# Altium schematic sheet TIDA-01560_BlankSheet.SchDoc
size 431 x 279 mm; Date: Not shown in title block; ApprovedBy: Not shown in title block; CheckedBy: Not shown in title block; Author: Not shown in title block; CompanyName: Not shown in title block; Engineer: Not shown in title block; Organization: Not shown in title block; Address1: Not shown in title block; Address2: Not shown in title block; Address3: Not shown in title block; Address4: Not shown in title block; DocumentNumber: 1; Revision: Use project parameter SCH_Rev; SheetNumber: 2; SheetTotal: 2; PageSetup: Record=PageOptions|CenterHorizontal=True|CenterVertical=True|PrintScale=1.00|XCorrection=1.00|YCorrection=1.00|PrintKind=0|BorderSize=5000000|LeftOffset=0|BottomOffset=0|Orientation=2|PaperLength=1000|PaperWidth=1000|Scale=100|PaperSource=15|PrintQuality=600|MediaType=1|DitherType=10|PaperKind=Letter|PrintScaleMode=1; CurrentTime: Not shown in title block; CurrentDate: Not shown in title block; Time: Not shown in title block; DocumentFullPathAndName: Not shown in title block; DocumentName: Not shown in title block; ModifiedDate: Not shown in title block; ImagePath: Not shown in title block
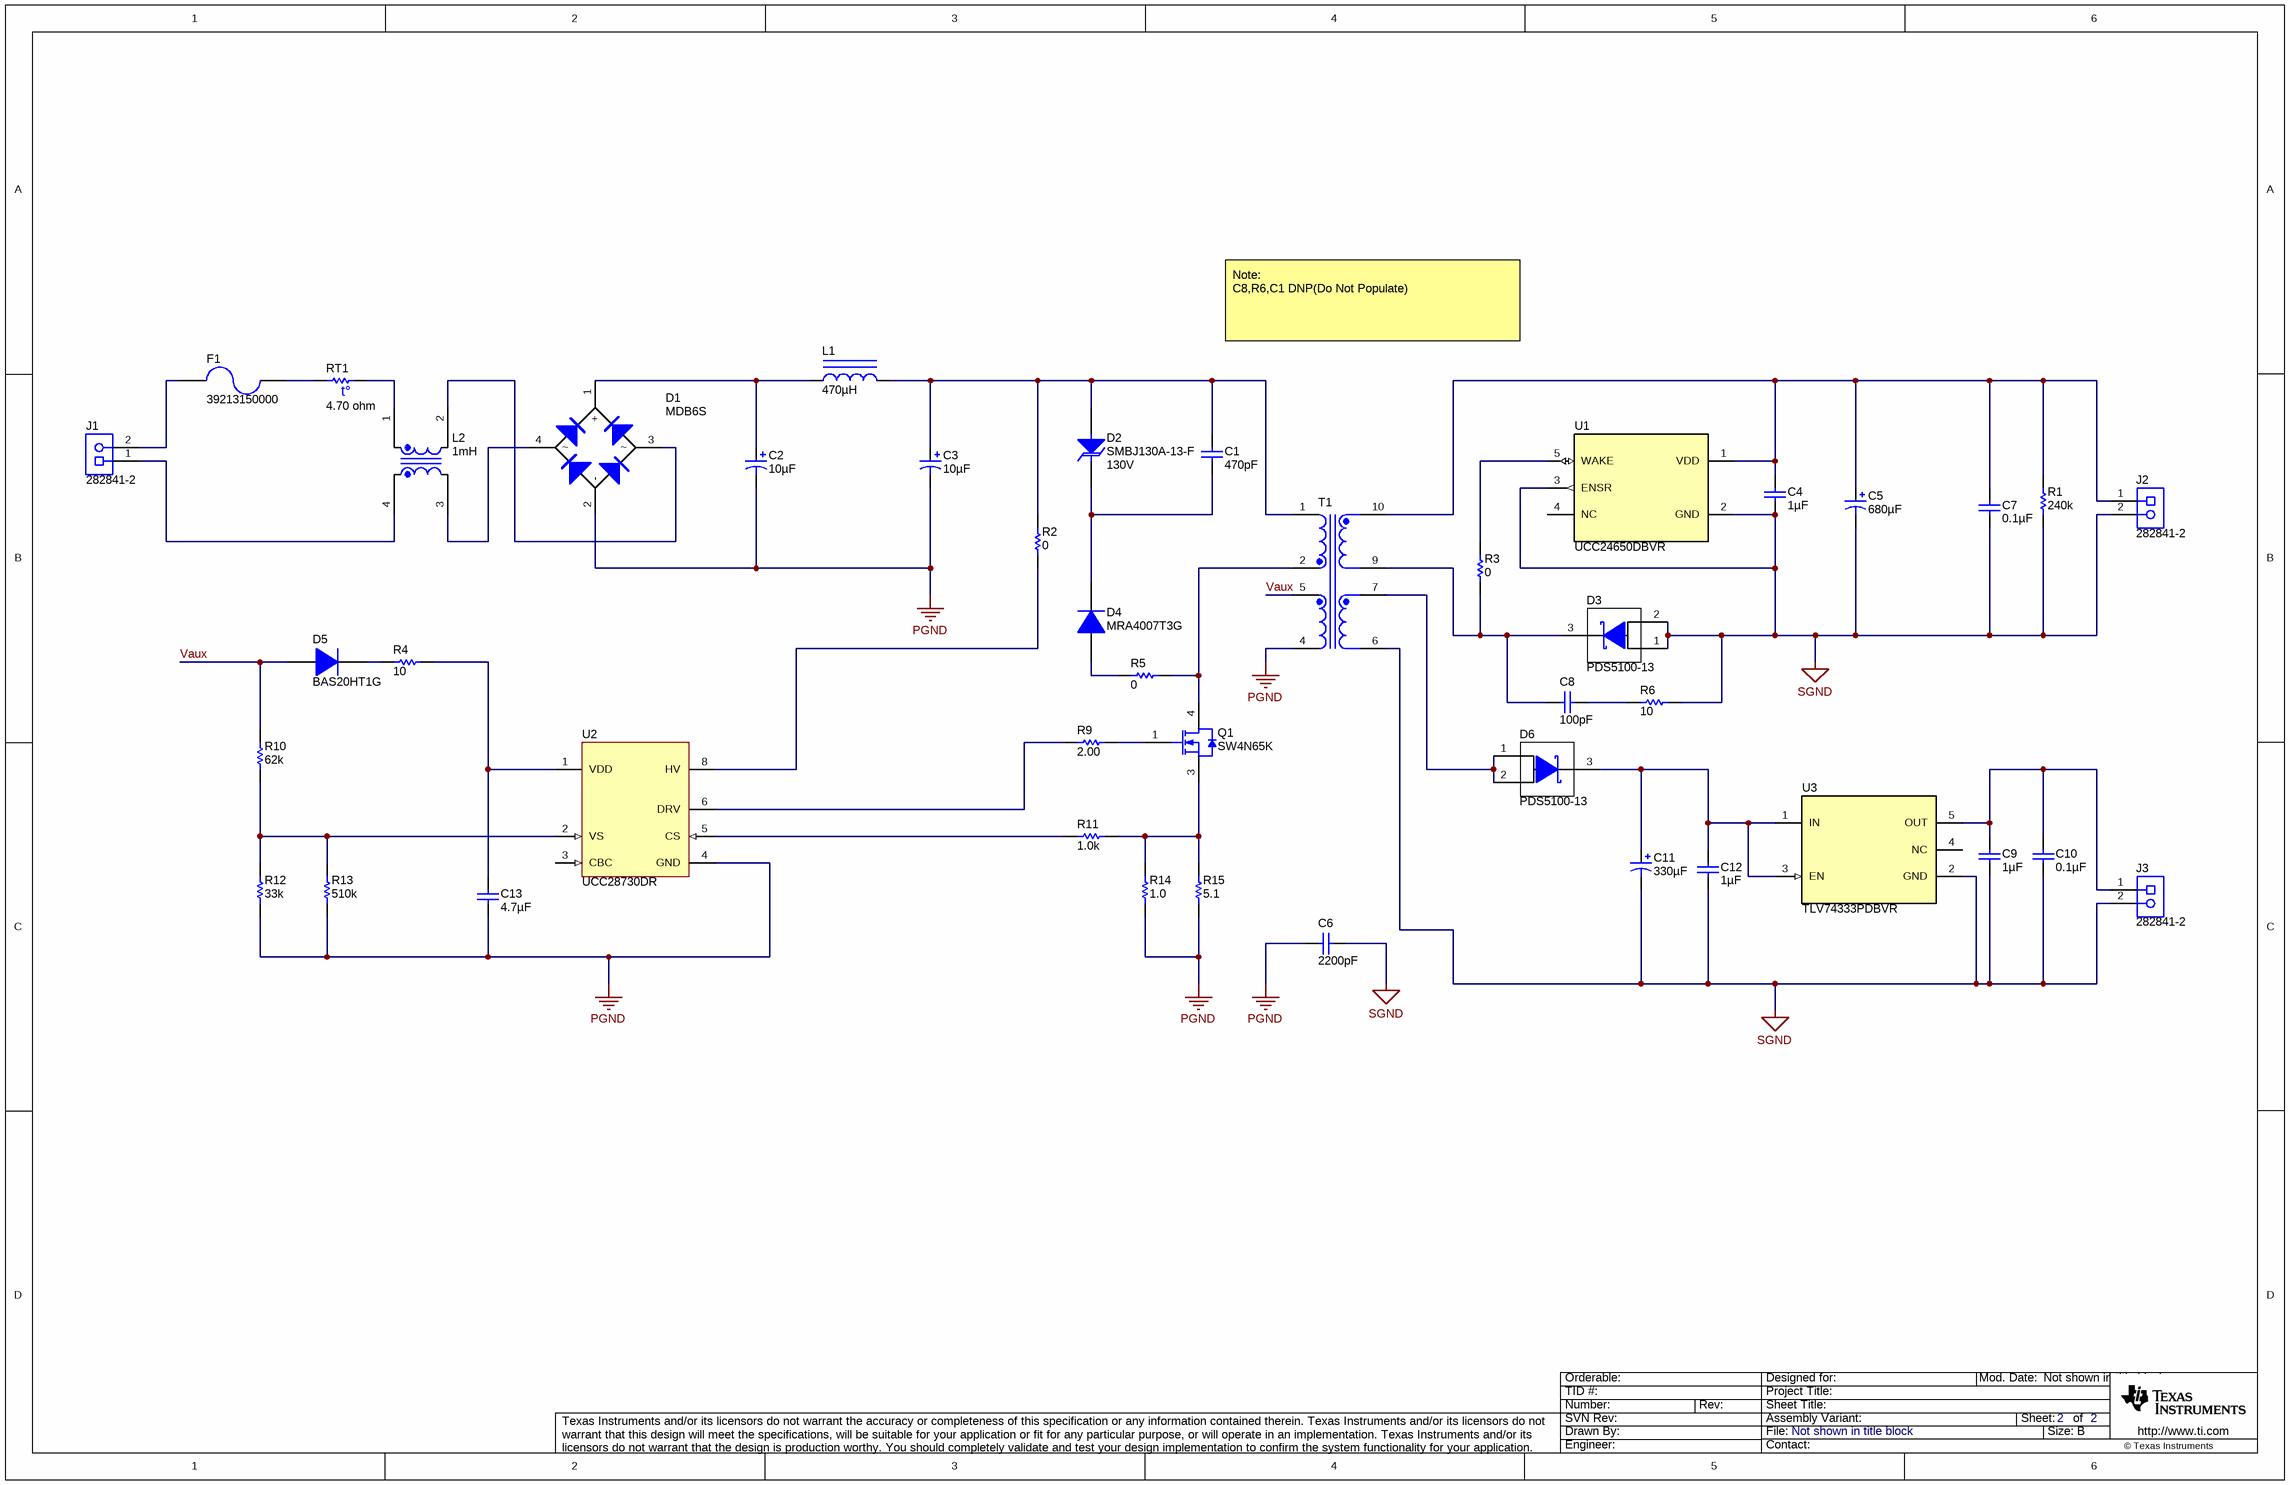
[diagram p0: TIDA-01560_BlankSheet.SchDoc]

## Parts
C1  ValueDisplayed: 470pF  [1206]  (hidden comment: GRM31A7U2J471JW31D)
C2  ValueDisplayed: 10µF  [CY_1000x1600]  (hidden comment: UCY2G100MPD1TD)
C3  ValueDisplayed: 10µF  [CY_1000x1600]  (hidden comment: UCY2G100MPD1TD)
C4  ValueDisplayed: 1µF  [0603]  (hidden comment: 06033C105KAT2A)
C5  ValueDisplayed: 680µF  [R7_1000x1250]  (hidden comment: APSG200ELL681MJB5S)
C6  ValueDisplayed: 2200pF  [KX_1000x800x1400]  (hidden comment: DE1E3KX222MN5AA01)
C7  ValueDisplayed: 0.1µF  [0603]  (hidden comment: C0603C104K3RACTU)
C8  ValueDisplayed: 100pF  [0805_HV]  (hidden comment: GCM2165C2A101JA16D)
C9  ValueDisplayed: 1µF  [0603]  (hidden comment: C1608X7R1E105K080AB)
C10  ValueDisplayed: 0.1µF  [0603]  (hidden comment: C0603C104K3RACTU)
C11  ValueDisplayed: 330µF  [SM_RADIAL_6.3AMM]  (hidden comment: 875105144010)
C12  ValueDisplayed: 1µF  [0603]  (hidden comment: C1608X7R1E105K080AB)
C13  ValueDisplayed: 4.7µF  [1206_180]  (hidden comment: C3216X7R1H475K160AC)
D1  MDB6S  [MICRODIP_4]
D2  SMBJ130A-13-F  value 130V  [SMB]
D3  PDS5100-13  [PowerDI5]
D4  MRA4007T3G  [SMA]
D5  BAS20HT1G  [sod-323]
D6  PDS5100-13  [PowerDI5]
F1  39213150000  [FUSE_392]
J1  282841-2  [TEC_282841-2]
J2  282841-2  [TEC_282841-2]
J3  282841-2  [TEC_282841-2]
L1  ValueDisplayed: 470µH  [WE-TI_5075]  (hidden comment: 7447462471)
L2  ValueDisplayed: 1mH  [WE-CMB_XS]  (hidden comment: 744821201)
Q1  SW4N65K  [TO-252]
R1  ValueDisplayed: 240k  [0805_HV]  (hidden comment: CRCW0805240KJNEA)
R2  ValueDisplayed: 0  [1206]  (hidden comment: CRCW12060000Z0EA)
R3  ValueDisplayed: 0  [0805_HV]  (hidden comment: CRCW08050000Z0EA)
R4  ValueDisplayed: 10  [0805_HV]  (hidden comment: CRCW080510R0JNEA)
R5  ValueDisplayed: 0  [1206]  (hidden comment: CRCW12060000Z0EA)
R6  ValueDisplayed: 10  [1206]  (hidden comment: CRCW120610R0JNEA)
R9  ValueDisplayed: 2.00  [0603]  (hidden comment: CRCW06032R00FKEA)
R10  ValueDisplayed: 62k  [0805_HV]  (hidden comment: CRCW080562K0JNEA)
R11  ValueDisplayed: 1.0k  [0603]  (hidden comment: CRCW06031K00JNEA)
R12  ValueDisplayed: 33k  [0603]  (hidden comment: CRCW060333K0JNEA)
R13  ValueDisplayed: 510k  [0603]  (hidden comment: CRCW0603510KJNEA)
R14  ValueDisplayed: 1.0  [0805_HV]  (hidden comment: CRCW08051R00JNEA)
R15  ValueDisplayed: 5.1  [0805_HV]  (hidden comment: CRCW08055R10JNEA)
RT1  value 4.70 ohm  [S153]  (hidden comment: B57153S0479M051)
T1  750343769,Rev02  [PCBComponent_1]  (value not drawn)
U1  UCC24650DBVR  [DBV0005A_N]
U2  UCC28730DR  [D0007A_N]
U3  TLV74333PDBVR  [DBV0005A_N]

## Nets
PGND: C2.2(-) C3.2(-) C6.2 C13.2 D1.2(-) R12.1 R13.1 R14.1 R15.1 T1.4 U2.4(GND)
SGND: C4.2 C5.2(-) C6.1 C7.2 C9.2 C10.2 C11.2(-) C12.2 D3.1(A) D3.2(A) J2.2 J3.2 R1.1 R6.2 T1.6 U1.2(GND) U1.3(ENSR) U3.2(GND)
Vaux: D5.2(A) R10.1 T1.5
NetC1_1: C1.1 C3.1(+) D2.2(A) L1.2 R2.2 T1.1
NetC1_2: C1.2 D2.1(K) D4.1(K)
NetC2_1: C2.1(+) D1.1(+) L1.1
NetC4_1: C4.1 C5.1(+) C7.1 J2.1 R1.2 T1.10 U1.1(VDD)
NetC8_1: C8.1 R6.1
NetC8_2: C8.2 D3.3(K) R3.1 T1.9
NetC9_1: C9.1 C10.1 J3.1 U3.5(OUT)
NetC11_1: C11.1(+) C12.1 D6.3(K) U3.1(IN) U3.3(EN)
NetC13_1: C13.1 R4.2 U2.1(VDD)
NetD1_3: D1.3 L2.2
NetD1_4: D1.4 L2.3
NetD4_2: D4.2(A) R5.1
NetD5_1: D5.1(K) R4.1
NetD6_1: D6.1(A) D6.2(A) T1.7
NetF1_1: F1.1 RT1.1
NetF1_2: F1.2 J1.2
NetJ1_1: J1.1 L2.4
NetL2_1: L2.1 RT1.2
NetQ1_1: Q1.1(G) R9.2
NetQ1_3: Q1.3(S) R11.2 R14.2 R15.2
NetQ1_4: Q1.4(D) R5.2 T1.2
NetR2_1: R2.1 U2.8(HV)
NetR3_2: R3.2 U1.5(WAKE)
NetR9_1: R9.1 U2.6(DRV)
NetR10_2: R10.2 R12.2 R13.2 U2.2(VS)
NetR11_1: R11.1 U2.5(CS)

Not connected (* = marked no-connect by the designer): U1 4(NC); U2 3(CBC); U3 4(NC)

## Notes on the sheet
- Note:
  C8,R6,C1 DNP(Do Not Populate)
- Drawn By:
- SVN Rev:
- Number:
- TID #:
- Orderable:
- Rev:
- Sheet Title:
- File:
- Project Title:
- Designed for:
- Assembly Variant:
- Mod. Date:
- Sheet:
- Size:
- of
- B
- http://www.ti.com
- Texas Instruments and/or its licensors do not warrant the accuracy or completeness of this specification or any information contained therein. Texas Instruments and/or its licensors do not warrant that this design will meet the specifications, will be suitable for your application or fit for any particular purpose, or will operate in an implementation. Texas Instruments and/or its licensors do not warrant that the design is production worthy. You should completely validate and test your design implementation to confirm the system functionality for your application.
- Engineer:
- Contact:
- © Texas Instruments
- (in symbol B57153S0479M051) t°

## Library data of the parts
C1 = GRM31A7U2J471JW31D: CAP, CERM, 470 pF, 630 V, +/- 5%, U2J, 1206; Manufacturer: MuRata; Polarized: N; CompType: Capacitor; Value: 470pF; U/M: EA; Cap_F: 0.00000000047; Tolerance_%: 5; Value1: Unknown; VDC_V: 630; Value2: 630V; TaMin_C: -55; TaMax_C: 125; AEC Category: Q200; SymbolVersion: 2008-07-09; PartNumber: GRM31A7U2J471JW31D; PackageReference: 1206; RoHS: Y; MountType: SMT; Technology: Ceramic; TempCo: U2J; Cap_Case: 1206; Published: 2008-06-19; Publisher: Texas Instruments; LatestRevisionDate: 2016-03-26; ComponentLink1Description: Datasheet link; ComponentLink1URL: http://search.murata.co.jp/Ceramy/PnsearchViewAction.do?HnOFG=ON&HnNFG=ON&SEL_CNT=50&sLang=en&sKey=GRM31A7U2J471JW31D&x=9&y=9&search=startwith; Supplier 1: Digi-Key; Supplier Part Number 1: 490-4294-1-ND; Supplier 2: Mouser; Supplier Part Number 2: 81-GRM31A7U2J471JD; Supplier 3: Farnell; Supplier Part Number 3: 2057298; AEC Qualified: ?
C2 C3 = UCY2G100MPD1TD: CAP, AL, 10 µF, 400 V, +/- 20%, TH; Manufacturer: Nichicon; Polarized: Y; CompType: Capacitor; Value: 10uF; U/M: EA; Cap_F: 0.00001; Tolerance_%: 20; Value1: Unknown; VDC_V: 400; Value2: 400V; IRMS_A: 0.15; TaMin_C: -40; TaMax_C: 105; Cap_Case: 10x16mm; AEC Category: Q200; SymbolVersion: 2008-07-09; PartNumber: UCY2G100MPD1TD; PackageReference: D10xL16; RoHS: Y; MountType: TH; Technology: AL; Series: CY; Publisher: Texas Instruments; LatestRevisionDate: 2016-03-24; ComponentLink1Description: Datasheet link; ComponentLink1URL: http://nichicon-us.com/english/products/pdfs/e-cy.pdf; Supplier 1: Digi-Key; Supplier Part Number 1: 493-13313-1-ND; AEC Qualified: ?
C4 = 06033C105KAT2A: CAP, CERM, 1 µF, 25 V,+/- 10%, X7R, 0603; Manufacturer: AVX; Polarized: N; CompType: Capacitor; Value: 1uF; U/M: EA; Cap_F: 0.000001; Tolerance_%: 10; VDC_V: 25; Value2: 25V; TaMin_C: -55; TaMax_C: 125; SizeArea_mm2: 1.28; SizeAreaWB_mm2: 4.68; SizeX_mm: 1.6; SizeY_mm: 0.8; SizeZ_mm: 1; AEC Category: Q200; SymbolVersion: 2008-07-09; PartNumber: 06033C105KAT2A; PackageReference: 0603; RoHS: Y; MountType: SMT; Technology: Ceramic; TempCo: X7R; Cap_Case: 0603; Published: 2008-06-19; Publisher: Texas Instruments; LatestRevisionDate: 2017-06-22; ComponentLink1Description: Datasheet link; ComponentLink1URL: http://datasheets.avx.com/X7RDielectric.pdf; Supplier 1: Digi-Key; Supplier Part Number 1: 478-10046-1-ND; Supplier 2: Newark; Supplier Part Number 2: 44X0680; Supplier 3: Mouser; Supplier Part Number 3: 581-06033C105KAT2A; AEC Qualified: N; AEC Grade: N/A
C5 = RR71C331MDN1: CAP, AL, 680 µF, 20 V, +/- 20%, 0.012 ohm, TH; Manufacturer: Chemi-Con; Polarized: Y; CompType: Capacitor; Value: 680uF; U/M: EA; Cap_F: 0.00033; Tolerance_%: 20; Value1: 0.007 ohm; VDC_V: 16; Value2: 16V; ESR_ohm: 0.007; IRMS_A: 6.1; TaMin_C: -55; TaMax_C: 105; Cap_Case: 10x12.5; SizeAreaWB_mm2: 144; SizeArea_mm2: 100; SizeX_mm: 10; SizeZ_mm: 14; AEC Category: Q200; AEC Qualified: N; SymbolVersion: 2008-07-09; PartNumber: APSG200ELL681MJB5S; PackageReference: D10x12.5mm; RoHS: Y; MountType: TH; Technology: AL; Series: R7; SizeY_mm: 10; Publisher: Texas Instruments; LatestRevisionDate: 2017-06-22; ComponentLink1Description: Datasheet link; ComponentLink1URL: http://www.nichicon.co.jp/english/products/pdf/2009fpcap_catalog_r7.pdf; Supplier 1: Digi-Key; Supplier Part Number 1: 493-3718-ND; Supplier 2: Newark; Supplier Part Number 2: 21T5150; Supplier 3: Mouser; Supplier Part Number 3: 647-RR71C331MDN1; AEC Grade: N/A
C6 = DE1E3KX222MN5AA01: CAP, CERM, 2200 pF, X1 250 VAC/Y1 300 VAC, +/- 20%, E, 10.0x8.0x14.0mm; Manufacturer: MuRata; Polarized: N; CompType: Capacitor; Value: 2200pF; U/M: EA; Cap_F: 0.0000000022; Tolerance_%: 20; TaMin_C: -25; TaMax_C: 85; Cap_Case: 10x8x14mm; SizeArea_mm2: 80; SizeAreaWB_mm2: 120; SizeX_mm: 10; SizeY_mm: 8; SizeZ_mm: 14; AEC Category: Q200; AC_Safety: X1Y1; VAC_X: 250; VAC_Y: 300; SymbolVersion: 2008-07-09; PartNumber: DE1E3KX222MN5AA01; PackageReference: 10.0x8.0x14.0mm; RoHS: Y; MountType: TH; Technology: Ceramic; TempCo: E; Published: 2008-06-19; Publisher: Texas Instruments; LatestRevisionDate: 2017-06-22; ComponentLink1Description: Datasheet link; ComponentLink1URL: http://psearch.murata.com/capacitor/product/DE1E3KX222MN5AA01.pdf; Supplier 1: Digi-Key; Supplier Part Number 1: 490-6012-1-ND; Supplier 2: Mouser; Supplier Part Number 2: 81-DE1E3KX222MN5AA01; AEC Qualified: ?
C7 C10 = C0603C104K3RACTU: CAP, CERM, 0.1 µF, 25 V,+/- 10%, X7R, 0603; Manufacturer: Kemet; Polarized: N; CompType: Capacitor; Value: 0.1uF; U/M: EA; Cap_F: 0.0000001; Tolerance_%: 10; VDC_V: 25; Value2: 25V; TaMin_C: -55; TaMax_C: 125; SizeArea_mm2: 1.28; SizeAreaWB_mm2: 4.68; SizeX_mm: 1.6; SizeY_mm: 0.8; SizeZ_mm: 1; AEC Category: Q200; Green_Lifecycle: Active; Green_REACh: Passed; SymbolVersion: 2008-07-09; PartNumber: C0603C104K3RACTU; PackageReference: 0603; RoHS: Y; MountType: SMT; Technology: Ceramic; TempCo: X7R; Cap_Case: 0603; Published: 2008-06-19; Publisher: Texas Instruments; LatestRevisionDate: 2017-06-22; ComponentLink1Description: Datasheet link; ComponentLink1URL: http://www.kemet.com/kemet/web/homepage/kechome.nsf/vapubfiles/F3102_Y5V.pdf/$file/F3102_Y5V.pdf; Supplier 1: Digi-Key; Supplier Part Number 1: 399-1281-1-ND; Supplier 2: Mouser; Supplier Part Number 2: 80-C0603C104K3R; Supplier 3: Farnell; Supplier Part Number 3: 1650835; AEC Qualified: ?; Green_EU RoHS: Passed; Green_EU RoHS-2: Passed
C8 = GCM2165C2A101JA16D: CAP, CERM, 100 pF, 100 V,+/- 5%, C0G/NP0, AEC-Q200 Grade 1, 0805; Manufacturer: MuRata; Polarized: N; CompType: Capacitor; Value: 100pF; U/M: EA; Cap_F: 0.0000000001; Tolerance_%: 5; VDC_V: 100; Value2: 100V; TaMin_C: -55; TaMax_C: 105; Cap_Case: 0805; SizeArea_mm2: 2.5; SizeAreaWB_mm2: 6.75; SizeX_mm: 2; SizeY_mm: 1.25; SizeZ_mm: 1.45; AEC Category: Q200; AEC Qualified: Y; AEC Grade: 1; SymbolVersion: 2008-07-09; PartNumber: GCM2165C2A101JA16D; PackageReference: 0805; RoHS: Y; MountType: SMT; Technology: Ceramic; TempCo: C0G/NP0; Published: 2008-06-19; Publisher: Texas Instruments; LatestRevisionDate: 2017-06-22; ComponentLink1Description: Datasheet link; ComponentLink1URL: http://psearch.murata.com/capacitor/product/GCM2165C2A101JA16%23.pdf; Supplier 1: Digi-Key; Supplier Part Number 1: 490-8035-1-ND; Supplier 2: Mouser; Supplier Part Number 2: 81-GCM2165C2A101JA6D
C9 C12 = C1608X7R1E105K080AB: CAP, CERM, 1 µF, 25 V,+/- 10%, X7R, 0603; Manufacturer: TDK; Polarized: N; CompType: Capacitor; Value: 1uF; U/M: EA; Cap_F: 0.000001; Tolerance_%: 10; VDC_V: 25; Value2: 25V; TaMin_C: -55; TaMax_C: 125; SizeArea_mm2: 1.28; SizeAreaWB_mm2: 4.68; SizeX_mm: 1.6; SizeY_mm: 0.8; SizeZ_mm: 1; AEC Category: Q200; Green_Lifecycle: Active; Green_REACh: Passed; SymbolVersion: 2008-07-09; PartNumber: C1608X7R1E105K080AB; PackageReference: 0603; RoHS: Y; MountType: SMT; Technology: Ceramic; TempCo: X7R; Cap_Case: 0603; Published: 2008-06-19; Publisher: Texas Instruments; LatestRevisionDate: 2017-06-22; ComponentLink1Description: Datasheet link; ComponentLink1URL: http://www.tdk.com/pdf/TDKMLCCCapRange.pdf; Supplier 1: Digi-Key; Supplier Part Number 1: 445-5956-1-ND; AEC Qualified: ?; Green_EU RoHS: Passed; Green_EU RoHS-2: Passed
C11 = UUD0J221MCL1GS: CAP, AL, 330 µF, 6.3 V, +/- 20%, 0.020 ohm, SMD; Manufacturer: Wurth Elektronik; Polarized: Y; CompType: Capacitor; Value: 330uF; U/M: EA; Cap_F: 0.00022; Tolerance_%: 20; VDC_V: 6.3; Value2: 6.3V; ESR_ohm: 0.44; IRMS_A: 0.23; TaMin_C: -55; TaMax_C: 105; Cap_Case: 6.3x5.8; SizeAreaWB_mm2: 79.98; SizeArea_mm2: 48.18; SizeX_mm: 7.3; SizeY_mm: 6.6; SizeZ_mm: 6; AEC Category: Q200; SymbolVersion: 2008-07-09; PartNumber: 875105144010; PackageReference: 6.3x5.8; RoHS: Y; Value1: 0.020 ohm; MountType: SMT; Technology: AL; Series: uD; Publisher: Texas Instruments; LatestRevisionDate: 2017-06-22; ComponentLink1Description: Datasheet link; ComponentLink1URL: http://products.nichicon.co.jp/en/pdf/XJA043/e-ud.pdf; Supplier 1: Digi-Key; Supplier 2: Mouser; Supplier 3: Farnell; AEC Qualified: ?
C13 = C3216X7R1H475K160AC: CAP, CERM, 4.7 µF, 50 V,+/- 10%, X7R, 1206; Manufacturer: TDK; Polarized: N; CompType: Capacitor; Value: 4.7uF; U/M: EA; Cap_F: 0.0000047; Tolerance_%: 10; ESR_ohm: 0.003158; Value1: 0.003158 ohm; VDC_V: 50; Value2: 50V; IRMS_A: 4.08379; TaMin_C: -55; TaMax_C: 125; Cap_Case: 1206; SizeArea_mm2: 5.12; SizeAreaWB_mm2: 10.92; SizeX_mm: 3.2; SizeY_mm: 1.6; SizeZ_mm: 1.8; AEC Category: Q200; SymbolVersion: 2008-07-09; PartNumber: C3216X7R1H475K160AC; PackageReference: 1206; RoHS: Y; MountType: SMT; Technology: Ceramic; TempCo: X7R; Published: 2008-06-19; Publisher: Texas Instruments; LatestRevisionDate: 2017-06-22; ComponentLink1Description: Datasheet link; ComponentLink1URL: https://product.tdk.com/en/search/capacitor/ceramic/mlcc/info?part_no=C3216X7R1H475K160AC; Supplier 1: Digi-Key; Supplier Part Number 1: 445-8032-1-ND; Supplier 2: Mouser; Supplier Part Number 2: 810-C3216X7R1H475K160AC; AEC Qualified: N; AEC Grade: N/A
D1 = MDB6S: Diode, Switching-Bridge, 600 V, 1 A, MICRODIP_4; Manufacturer: Fairchild Semiconductor; U/M: EA; Vf_V: 1.1; Value: 600V; Value1: 1A; Value2: 1.1V; Io_A: 1; Vr_V: 600; TJmax_C: 150; SizeAreaWB_mm2: 59.5; SizeArea_mm2: 32.5; SizeX_mm: 6.5; SizeY_mm: 5; SizeZ_mm: 1.45; AEC Category: Q101; Green_Lifecycle: Not Set; Green_REACh: Incomplete; SymbolVersion: 2008-07-09; PartNumber: MDB6S; PackageReference: MICRODIP_4; CompType: Diode; MountType: SMT; Type: Switching-Bridge; RoHS: Y; Published: 2008-06-26; Publisher: Texas Instruments; LatestRevisionDate: 2017-06-26; ComponentLink1Description: Datasheet link; ComponentLink1URL: http://www.fairchildsemi.com/ds/MD/MDB10S.pdf; Supplier 1: Digi-Key; Supplier Part Number 1: MDB6SFSCT-ND; Supplier 2: Newark; Supplier Part Number 2: 95T0264; Supplier 3: Mouser; Supplier Part Number 3: 512-MDB6S; AEC Qualified: ?; Green_EU RoHS: Incomplete; Green_EU RoHS-2: Incomplete
D2 = SMBJ130A-13-F: Diode, TVS, Uni, 130 V, 209 Vc, SMB; Manufacturer: Diodes Inc.; U/M: EA; Power_W: 5; Vr_V: 130; Value1: 5W; SizeAreaWB_mm2: 44.156; SizeArea_mm2: 21.336; SizeX_mm: 5.6; SizeY_mm: 3.81; SizeZ_mm: 2.6; AEC Category: Q101; Green_Lifecycle: Active; Green_REACh: Passed; CompType: TVS; SymbolVersion: 2012-01-13; PartNumber: SMBJ130A-13-F; PackageReference: SMB; Vz_V: N/A; MountType: SMT; RoHS: Y; ComponentLink1Description: Datasheet link; ComponentLink1URL: http://www.diodes.com/datasheets/ds19002.pdf; Published: 2008-10-08; Publisher: Texas Instruments; LatestRevisionDate: 2017-06-20; LatestRevisionNote: Updated Supplier Data; Supplier 1: Digi-Key; Supplier Part Number 1: SMBJ130A-FDICT-ND; Supplier 2: Mouser; Supplier Part Number 2: 621-SMBJ130A-13-F; AEC Qualified: ?; Green_EU RoHS: Passed with Exemption; Green_EU RoHS-2: Passed
D3 D6 = PDS5100-13: Diode, Schottky, 100 V, 5 A, PowerDI5; Manufacturer: Diodes Inc.; U/M: EA; Vf_V: 0.79; Value: 100V; Value1: 5A; Value2: 0.79V; Io_A: 5; Vr_V: 100; TJmax_C: 150; SizeAreaWB_mm2: 49.56; SizeArea_mm2: 24.96; SizeX_mm: 6.4; SizeY_mm: 3.9; SizeZ_mm: 1.05; AEC Category: Q101; Green_Lifecycle: Not Set; Green_REACh: Incomplete; SymbolVersion: 2008-12-08; PartNumber: PDS5100-13; PackageReference: PowerDI5; CompType: Diode; MountType: SMT; Type: Schottky; RoHS: Y; Published: 2008-06-26; Publisher: Texas Instruments; LatestRevisionDate: 2017-06-26; ComponentLink1Description: Datasheet link; ComponentLink1URL: http://www.diodes.com/datasheets/ds30483.pdf; Supplier 1: Digi-Key; Supplier Part Number 1: PDS5100DICT-ND; Supplier 2: Newark; Supplier Part Number 2: 25R4904; Supplier 3: Mouser; Supplier Part Number 3: 621-PDS5100-13; AEC Qualified: ?; Green_EU RoHS: Incomplete; Green_EU RoHS-2: Incomplete
D4 = MRA4007T3G: Diode, Standard Recovery Rectifier, 1000 V, 1 A, AEC-Q101, SMA; Manufacturer: ON Semiconductor; U/M: EA; Vf_V: 1.1; Value: 1000V; Value1: 1A; Value2: 1.1V; Io_A: 1; Vr_V: 1000; TJmax_C: 175; RJC_CperW: 16.2; SizeAreaWB_mm2: 37.3428; SizeArea_mm2: 16.3228; SizeX_mm: 5.59; SizeY_mm: 2.92; SizeZ_mm: 2.87; AEC Category: Q101; AEC Qualified: Y; Green_Lifecycle: Active; Green_REACh: Passed; SymbolVersion: 2008-12-08; PartNumber: MRA4007T3G; PackageReference: SMA; CompType: Diode; MountType: SMT; Type: Standard Recovery Rectifier; RoHS: Y; Published: 2008-06-26; Publisher: Texas Instruments; LatestRevisionDate: 2017-06-26; ComponentLink1Description: Datasheet link; ComponentLink1URL: http://www.onsemi.com/pub_link/Collateral/MRA4003T3-D.PDF; Supplier 1: Digi-Key; Supplier Part Number 1: MRA4007T3GOSCT-ND; Supplier 2: Newark; Supplier Part Number 2: 20J4309; Supplier 3: Mouser; Supplier Part Number 3: 863-MRA4007T3G; Green_EU RoHS: Passed with Exemption; Green_EU RoHS-2: Passed
D5 = BAS20HT1G: Diode, Switching, 200 V, 0.2 A, AEC-Q101, SOD-323; Manufacturer: ON Semiconductor; U/M: EA; Vf_V: 1.25; Value: 200V; Value1: 0.2A; Value2: 1.25V; Io_A: 0.2; Vr_V: 200; TJmax_C: 150; AEC Category: Q101; AEC Qualified: Y; SymbolVersion: 2008-12-08; PartNumber: BAS20HT1G; PackageReference: SOD-323; CompType: Diode; MountType: SMT; Type: Switching; RoHS: Y; Published: 2008-06-26; Publisher: Texas Instruments; LatestRevisionDate: 2016-01-08; ComponentLink1Description: Datasheet link; ComponentLink1URL: http://www.onsemi.com/pub_link/Collateral/BAS20HT1-D.PDF; Supplier 1: Digi-Key; Supplier Part Number 1: BAS20HT1GOSCT-ND; Supplier 2: Mouser; Supplier Part Number 2: BAS20HT1G; Supplier 3: Farnell; Supplier Part Number 3: 1147599
F1 = 39213150000: Fuse, 3.15 A, 250VAC/VDC, TH; Manufacturer: Littelfuse; VDC_V: 250; Irating_A: 3.15; SymbolVersion: 2008-07-09; PartNumber: 39213150000; PackageReference: 8x8.5x4mm; MountType: TH; CompType: Fuse; RoHS: Y; VAC_V: 250; Published: 2009-03-05; Publisher: Texas Instruments; LatestRevisionDate: 2015-11-23; ComponentLink1Description: Datasheet URL; ComponentLink1URL: http://www.littelfuse.com/data/en/Data_Sheets/Ltitelfuse_Fuse_392.pdf; Supplier 1: Digi-Key; Supplier Part Number 1: F5504CT-ND; Supplier 2: Mouser; Supplier Part Number 2: 576-3921315000; Supplier 3: Farnell; Supplier Part Number 3: 1757614
J1-J3 = 282841-2: Terminal Block, 2x1, 5.08mm, TH; Manufacturer: TE Connectivity; SymbolCreator: a0412235; SymbolVersion: 2013-09-04; PartNumber: 282841-2; PackageReference: 10.16x15.2x9mm; CompType: Terminal Block; RoHS: Y; MountType: TH; ComponentLink1Description: Datasheet URL; ComponentLink1URL: http://www.te.com/commerce/DocumentDelivery/DDEController?Action=srchrtrv&DocNm=282841&DocType=Customer+Drawing&DocLang=English; Publisher: Texas Instruments; LatestRevisionDate: 2016-01-14; Supplier 1: Digi-Key; Supplier Part Number 1: A98342-ND; Supplier 2: Mouser; Supplier Part Number 2: 571-2828412; Supplier 3: Farnell; Supplier Part Number 3: 1767503
L1 = 7447462471: Inductor, Unshielded Drum Core, Ferrite, 470 µH, 0.35 A, 1.58 ohm, TH; Manufacturer: Wurth Elektronik; Value: 470uH; Ind_H: 470.0E-6; Imax_A: 0.35; Irms: 0.35A @ 40C rise; Isat: 0.4A @ 10% inductance drop; DCR_ohm: 1.58; Value2: 0.35A; SizeAreaWB_mm2: 64; SizeArea_mm2: 36; SizeX_mm: 6; SizeZ_mm: 8.5; AEC Category: Q200; Green_Lifecycle: Active; Green_REACh: Passed; SymbolVersion: 2008-07-23; CompType: Inductor; PartNumber: 7447462471; Value1: 1.58 ohm; Technology: Unshielded Drum Core; MountType: TH; Material: Ferrite; PackageReference: D6 x 8.5mm; Published: 2008-06-26; Publisher: Texas Instruments; LatestRevisionDate: 2017-06-26; ComponentLink1Description: Datasheet link; ComponentLink1URL: http://katalog.we-online.de/kataloge/eisos/media/pdf/7447462471.pdf; RoHS: Y; SizeY_mm: 6; Supplier 1: Digi-Key; Supplier Part Number 1: 732-2575-ND; AEC Qualified: ?; Green_EU RoHS: Passed; Green_EU RoHS-2: Incomplete
L2 = 744821201: Coupled inductor, 1 mH, 2 A, 0.045 ohm, TH; Manufacturer: Wurth Elektronik; SymbolCreator: a0412235; Value: 1mH; Ind_H: 1.0E-3; DCR_ohm: 0.045; SymbolVersion: 2013-02-26; PartNumber: 744821201; PackageReference: 15 x 18 x 7.5mm; MountType: TH; ComponentLink1URL: http://katalog.we-online.de/pbs/datasheet/744821201.pdf; ComponentLink1Description: Datasheet URL; RoHS: Y; CompType: Coupled Inductor; Publisher: Texas Instruments; Published: 2008-05-16; LatestRevisionDate: 2016-01-11; Supplier 1: Digi-Key; Supplier Part Number 1: 732-1435-ND; Supplier 2: Mouser; Supplier Part Number 2: 710-744821201; Supplier 3: Farnell; Supplier Part Number 3: 1636278
Q1 = IXTY02N120P: MOSFET, N-CH, 650 V, 4 A, TO-252; Manufacturer: IXYS; Alternate Manufacturer: None; U/M: EA; ChType: N; Value: 650V; VdsMax_V: 1200; Value1: ? ohm; Value2: 4.7 nC; QgTyp_nC: 4.7; Vgs_V: 20; IdsMax_A: 0.2; SizeAreaWB_mm2: 79.794; SizeArea_mm2: 48.034; SizeX_mm: 6.58; SizeY_mm: 7.3; SizeZ_mm: 2.3; AEC Category: Q101; Green_Lifecycle: Not Set; Green_REACh: Incomplete; SymbolVersion: 2008-07-28; CompType: MOSFET; PartNumber: SW4N65K; PackageReference: TO-252; RoHS: Y; MountType: SMT; Published: 2008-06-19; Publisher: Texas Instruments; LatestRevisionDate: 2017-06-26; LatestRevisionNote: Added parts.; ComponentLink1Description: Datasheet link; ComponentLink1URL: http://ixapps.ixys.com/DataSheet/DS100201A(IXTP-TY02N120P).pdf; Supplier 1: Digi-Key; Supplier Part Number 1: IXTY02N120P-ND; Supplier 2: Mouser; Supplier Part Number 2: 747-IXTY02N120P; AEC Qualified: ?; Green_EU RoHS: Incomplete; Green_EU RoHS-2: Incomplete
R1 = CRCW0805240KJNEA: RES, 240 k, 5%, 0.125 W, 0805; Manufacturer: Vishay-Dale; CompType: Resistor; Value: 240k; Res_ohm: 240000; Tolerance_%: 5; Power_W: 0.125; Value2: 0.125W; VDC_V: 150; TempCo: 200 ppm/C; EIA_Code: E24; U/M: EA; AEC Category: Q200; SizeArea_mm2: 2.5; SizeX_mm: 2; SizeY_mm: 1.25; SizeZ_mm: 1.45; SymbolVersion: 2009-05-29; PartNumber: CRCW0805240KJNEA; PackageReference: 0805; RoHS: Y; Value_Code: 240k; Value1: 5%; MountType: SMT; Technology: Thick Film; Published: 2008-06-26; Publisher: Texas Instruments; LatestRevisionDate: 2017-06-23; ComponentLink1Description: Datasheet link; ComponentLink1URL: http://www.vishay.com/docs/20035/dcrcwe3.pdf; Supplier 1: Digi-Key; Supplier Part Number 1: 541-240KACT-ND; AEC Qualified: ?
R2 R5 = CRCW12060000Z0EA: RES, 0, 5%, 0.25 W, 1206; Manufacturer: Vishay-Dale; CompType: Resistor; Value: 0; Value_Code: 0000; Tolerance_%: 5; Power_W: 0.25; Value2: 0.25W; VDC_V: 200; TempCo: 200 ppm/C; SizeArea_mm2: 5.12; SizeX_mm: 3.2; SizeY_mm: 1.6; SizeZ_mm: 1.35; EIA_Code: E24; U/M: EA; AEC Category: Q200; Green_Lifecycle: Active; Green_REACh: Passed; SymbolVersion: 2009-05-29; PartNumber: CRCW12060000Z0EA; PackageReference: 1206; RoHS: Y; Res_ohm: 0; Value1: 5%; MountType: SMT; Technology: Thick Film; Published: 2008-06-26; Publisher: Texas Instruments; LatestRevisionDate: 2017-06-12; ComponentLink1Description: Datasheet link; ComponentLink1URL: http://www.vishay.com/docs/20035/dcrcwe3.pdf; Supplier 1: Digi-Key; Supplier Part Number 1: 541-0.0ECT-ND; Supplier 2: Newark; Supplier Part Number 2: 53K1777; Supplier 3: Mouser; Supplier Part Number 3: 71-CRCW1206-0-E3; AEC Qualified: ?; Green_EU RoHS: Passed with Exemption; Green_EU RoHS-2: Passed
R3 = CRCW08050000Z0EA: RES, 0, 5%, 0.125 W, 0805; Manufacturer: Vishay-Dale; CompType: Resistor; Value: 0; Value_Code: 0000; Tolerance_%: 5; Power_W: 0.125; Value2: 0.125W; VDC_V: 150; TempCo: 200 ppm/C; SizeArea_mm2: 2.5; SizeX_mm: 2; SizeY_mm: 1.25; SizeZ_mm: 1.45; EIA_Code: E24; U/M: EA; AEC Category: Q200; Green_Lifecycle: Active; Green_REACh: Passed; SymbolVersion: 2009-05-29; PartNumber: CRCW08050000Z0EA; PackageReference: 0805; RoHS: Y; Res_ohm: 0; Value1: 5%; MountType: SMT; Technology: Thick Film; Published: 2008-06-26; Publisher: Texas Instruments; LatestRevisionDate: 2017-06-23; ComponentLink1Description: Datasheet link; ComponentLink1URL: http://www.vishay.com/docs/20035/dcrcwe3.pdf; Supplier 1: Digi-Key; Supplier Part Number 1: 541-0.0ACT-ND; Supplier 2: Newark; Supplier Part Number 2: 52K9721; Supplier 3: Mouser; Supplier Part Number 3: 71-CRCW0805-0-E3; AEC Qualified: ?; Green_EU RoHS: Passed with Exemption; Green_EU RoHS-2: Passed
R4 = CRCW080510R0JNEA: RES, 10, 5%, 0.125 W, 0805; Manufacturer: Vishay-Dale; CompType: Resistor; Value: 10; Value_Code: 10R0; Tolerance_%: 5; Power_W: 0.125; Value2: 0.125W; VDC_V: 150; TempCo: 200 ppm/C; EIA_Code: E24; U/M: EA; AEC Category: Q200; SizeArea_mm2: 2.5; SizeX_mm: 2; SizeY_mm: 1.25; SizeZ_mm: 1.45; Green_Lifecycle: Active; Green_REACh: Passed; SymbolVersion: 2009-05-29; PartNumber: CRCW080510R0JNEA; PackageReference: 0805; RoHS: Y; Res_ohm: 10; Value1: 5%; MountType: SMT; Technology: Thick Film; Published: 2008-06-26; Publisher: Texas Instruments; LatestRevisionDate: 2017-06-23; ComponentLink1Description: Datasheet link; ComponentLink1URL: http://www.vishay.com/docs/20035/dcrcwe3.pdf; Supplier 1: Digi-Key; Supplier Part Number 1: 541-10ACT-ND; Supplier 2: Newark; Supplier Part Number 2: 59M6849; Supplier 3: Mouser; Supplier Part Number 3: 71-CRCW080510R0JNEA; AEC Qualified: ?; Green_EU RoHS: Passed with Exemption; Green_EU RoHS-2: Passed
R6 = CRCW120610R0JNEA: RES, 10, 5%, 0.25 W, 1206; Manufacturer: Vishay-Dale; CompType: Resistor; Value: 10; Value_Code: 10R0; Tolerance_%: 5; Power_W: 0.25; Value2: 0.25W; VDC_V: 200; TempCo: 200 ppm/C; EIA_Code: E24; U/M: EA; AEC Category: Q200; SymbolVersion: 2009-05-29; PartNumber: CRCW120610R0JNEA; PackageReference: 1206; RoHS: Y; Res_ohm: 10; Value1: 5%; MountType: SMT; Technology: Thick Film; Published: 2008-06-26; Publisher: Texas Instruments; LatestRevisionDate: 2015-10-21; ComponentLink1Description: Datasheet link; ComponentLink1URL: http://www.vishay.com/docs/20035/dcrcwe3.pdf; Supplier 1: Digi-Key; Supplier Part Number 1: 541-10ECT-ND; Supplier 2: Mouser; Supplier Part Number 2: 71-CRCW1206J-10-E3; Supplier 3: Farnell; Supplier Part Number 3: 1152618; AEC Qualified: ?
R9 = CRCW06032R00FKEA: RES, 2.00, 1%, 0.1 W, 0603; Manufacturer: Vishay-Dale; CompType: Resistor; Value: 2.00; Res_ohm: 2; Value_Code: 2R00; Tolerance_%: 1; Power_W: 0.1; Value2: 0.1W; VDC_V: 75; TempCo: 100 ppm/C; EIA_Code: E96; U/M: EA; AEC Category: Q200; SymbolVersion: 2009-05-29; PartNumber: CRCW06032R00FKEA; PackageReference: 0603; RoHS: Y; Value1: 1%; MountType: SMT; Technology: Thick Film; Published: 2008-06-26; Publisher: Texas Instruments; LatestRevisionDate: 2016-03-05; ComponentLink1Description: Datasheet link; ComponentLink1URL: http://www.vishay.com/docs/20035/dcrcwe3.pdf; Supplier 1: Digi-Key; Supplier Part Number 1: 541-2.00HHCT-ND; Supplier 2: Mouser; Supplier Part Number 2: 71-CRCW06032R00FKEA; Supplier 3: Farnell; Supplier Part Number 3: 1862038; AEC Qualified: ?
R10 = CRCW080562K0JNEA: RES, 62 k, 5%, 0.125 W, 0805; Manufacturer: Vishay-Dale; CompType: Resistor; Value: 62k; Res_ohm: 62000; Value_Code: 62k0; Tolerance_%: 5; Power_W: 0.125; Value2: 0.125W; VDC_V: 150; TempCo: 200 ppm/C; EIA_Code: E24; U/M: EA; AEC Category: Q200; SizeArea_mm2: 2.5; SizeX_mm: 2; SizeY_mm: 1.25; SizeZ_mm: 1.45; SymbolVersion: 2009-05-29; PartNumber: CRCW080562K0JNEA; PackageReference: 0805; RoHS: Y; Value1: 5%; MountType: SMT; Technology: Thick Film; Published: 2008-06-26; Publisher: Texas Instruments; LatestRevisionDate: 2017-06-23; ComponentLink1Description: Datasheet link; ComponentLink1URL: http://www.vishay.com/docs/20035/dcrcwe3.pdf; Supplier 1: Digi-Key; Supplier Part Number 1: 541-62KACT-ND; Supplier 2: Newark; Supplier Part Number 2: 59M6927; Supplier 3: Mouser; Supplier Part Number 3: 71-CRCW080562K0JNEA; AEC Qualified: ?
R11 = CRCW06031K00JNEA: RES, 1.0 k, 5%, 0.1 W, 0603; Manufacturer: Vishay-Dale; CompType: Resistor; Value: 1.0k; Res_ohm: 1000; Value_Code: 1k00; Tolerance_%: 5; Power_W: 0.1; Value2: 0.1W; VDC_V: 75; TempCo: 200 ppm/C; EIA_Code: E24; U/M: EA; AEC Category: Q200; SizeArea_mm2: 1.28; SizeX_mm: 1.6; SizeY_mm: 0.8; SizeZ_mm: 1; Green_Lifecycle: Active; Green_REACh: Passed; SymbolVersion: 2009-05-29; PartNumber: CRCW06031K00JNEA; PackageReference: 0603; RoHS: Y; Value1: 5%; MountType: SMT; Technology: Thick Film; Published: 2008-06-26; Publisher: Texas Instruments; LatestRevisionDate: 2017-06-13; ComponentLink1Description: Datasheet link; ComponentLink1URL: http://www.vishay.com/docs/20035/dcrcwe3.pdf; Supplier 1: Digi-Key; Supplier Part Number 1: 541-1.0KGCT-ND; Supplier 2: Newark; Supplier Part Number 2: 59M6750; Supplier 3: Mouser; Supplier Part Number 3: 71-CRCW0603J-1.0K-E3; AEC Qualified: ?; Green_EU RoHS: Passed with Exemption; Green_EU RoHS-2: Passed
R12 = CRCW060333K0JNEA: RES, 33 k, 5%, 0.1 W, 0603; Manufacturer: Vishay-Dale; CompType: Resistor; Value: 33k; Res_ohm: 33000; Value_Code: 33k0; Tolerance_%: 5; Power_W: 0.1; Value2: 0.1W; VDC_V: 75; TempCo: 200 ppm/C; EIA_Code: E24; U/M: EA; AEC Category: Q200; SizeArea_mm2: 1.28; SizeX_mm: 1.6; SizeY_mm: 0.8; SizeZ_mm: 1; Green_Lifecycle: Active; Green_REACh: Passed; SymbolVersion: 2009-05-29; PartNumber: CRCW060333K0JNEA; PackageReference: 0603; RoHS: Y; Value1: 5%; MountType: SMT; Technology: Thick Film; Published: 2008-06-26; Publisher: Texas Instruments; LatestRevisionDate: 2017-06-13; ComponentLink1Description: Datasheet link; ComponentLink1URL: http://www.vishay.com/docs/20035/dcrcwe3.pdf; Supplier 1: Digi-Key; Supplier Part Number 1: 541-33KGCT-ND; Supplier 2: Newark; Supplier Part Number 2: 59M6802; Supplier 3: Mouser; Supplier Part Number 3: 71-CRCW0603J-33K-E3; AEC Qualified: ?; Green_EU RoHS: Passed with Exemption; Green_EU RoHS-2: Passed
R13 = CRCW0603510KJNEA: RES, 510 k, 5%, 0.1 W, 0603; Manufacturer: Vishay-Dale; CompType: Resistor; Value: 510k; Res_ohm: 510000; Tolerance_%: 5; Power_W: 0.1; Value2: 0.1W; VDC_V: 75; TempCo: 200 ppm/C; EIA_Code: E24; U/M: EA; AEC Category: Q200; SizeArea_mm2: 1.28; SizeX_mm: 1.6; SizeY_mm: 0.8; SizeZ_mm: 1; Green_Lifecycle: Active; Green_REACh: Passed; SymbolVersion: 2009-05-29; PartNumber: CRCW0603510KJNEA; PackageReference: 0603; RoHS: Y; Value_Code: 510k; Value1: 5%; MountType: SMT; Technology: Thick Film; Published: 2008-06-26; Publisher: Texas Instruments; LatestRevisionDate: 2017-06-13; ComponentLink1Description: Datasheet link; ComponentLink1URL: http://www.vishay.com/docs/20035/dcrcwe3.pdf; Supplier 1: Digi-Key; Supplier Part Number 1: 541-510KGCT-ND; Supplier 2: Newark; Supplier Part Number 2: 89M6780; Supplier 3: Mouser; Supplier Part Number 3: 71-CRCW0603J-510K-E3; AEC Qualified: ?; Green_EU RoHS: Passed with Exemption; Green_EU RoHS-2: Passed
R14 = CRCW08051R00JNEA: RES, 1.0, 5%, 0.125 W, 0805; Manufacturer: Vishay-Dale; CompType: Resistor; Value: 1.0; Res_ohm: 1; Value_Code: 1R00; Tolerance_%: 5; Power_W: 0.125; Value2: 0.125W; VDC_V: 150; TempCo: 200 ppm/C; SizeArea_mm2: 2.5; SizeX_mm: 2; SizeY_mm: 1.25; SizeZ_mm: 1.45; EIA_Code: E24; U/M: EA; AEC Category: Q200; Green_Lifecycle: Active; Green_REACh: Passed; SymbolVersion: 2009-05-29; PartNumber: CRCW08051R00JNEA; PackageReference: 0805; RoHS: Y; Value1: 5%; MountType: SMT; Technology: Thick Film; Published: 2008-06-26; Publisher: Texas Instruments; LatestRevisionDate: 2017-06-23; ComponentLink1Description: Datasheet link; ComponentLink1URL: http://www.vishay.com/docs/20035/dcrcwe3.pdf; Supplier 1: Digi-Key; Supplier Part Number 1: 541-1.0ACT-ND; Supplier 2: Newark; Supplier Part Number 2: 59M6846; Supplier 3: Mouser; Supplier Part Number 3: 71-CRCW08051R00JNEA; AEC Qualified: ?; Green_EU RoHS: Passed with Exemption; Green_EU RoHS-2: Passed
R15 = CRCW08055R10JNEA: RES, 5.1, 5%, 0.125 W, 0805; Manufacturer: Vishay-Dale; CompType: Resistor; Value: 5.1; Value_Code: 5R10; Tolerance_%: 5; Power_W: 0.125; Value2: 0.125W; VDC_V: 150; TempCo: 200 ppm/C; SizeArea_mm2: 2.5; SizeX_mm: 2; SizeY_mm: 1.25; SizeZ_mm: 1.45; EIA_Code: E24; U/M: EA; AEC Category: Q200; SymbolVersion: 2009-05-29; PartNumber: CRCW08055R10JNEA; PackageReference: 0805; RoHS: Y; Res_ohm: 5.1; Value1: 5%; MountType: SMT; Technology: Thick Film; Published: 2008-06-26; Publisher: Texas Instruments; LatestRevisionDate: 2017-06-23; ComponentLink1Description: Datasheet link; ComponentLink1URL: http://www.vishay.com/docs/20035/dcrcwe3.pdf; Supplier 1: Digi-Key; Supplier Part Number 1: 541-5.1ACT-ND; Supplier 2: Newark; Supplier Part Number 2: 59M6918; Supplier 3: Mouser; Supplier Part Number 3: 71-CRCW08055R10JNEA; AEC Qualified: ?
RT1 = B57153S0479M051: Thermistor NTC, 4.70 ohm, 20%, 8.5mm Disc; Manufacturer: TDK; Tolerance_%: 20; Power_W: 1.4; TaMin_C: -55; TaMax_C: 170; U/M: EA; CompType: ThermistorNTC; SymbolVersion: 2008-11-25; PartNumber: B57153S0479M051; Series: S153; PackageReference: 8.5mm Disc; MountType: TH; RoHS: Y; ComponentLink1Description: Datasheet link; ComponentLink1URL: http://en.tdk.eu/inf/50/db/icl_13/B57153_S153.pdf; Published: 2009-09-22; Publisher: Texas Instruments; LatestRevisionDate: 2017-03-31; Supplier 1: Digi-Key; Supplier Part Number 1: B57153S479M51-ND; Supplier 2: Mouser; Supplier Part Number 2: 871-B57153S479M51
T1 = Component_1: Transformer, 620uH, TH; Manufacturer: Wurth Elektronik; SymbolVersion: use current date i.e. 2008-05-20; SymbolCreator: Use a-id; CompType: Used in some BOM reports.  Useful for finding later.; U/M: EA, IN, or GM; MountType: SMT, TH, or N/A; RoHS: Used in BOM report.  Use Y or N.; PartNumber: 750343769,Rev02; PackageReference: 29x21.5mm; ComponentLink1Description: Datasheet Link; Alternate PartNumber: -; Alternate Manufacturer: -
U1 = UCC24650DBVR: 200-V Wake-Up Monitor for Fast Transient PSR, DBV0005A; Alternate PartNumber: UCC24650DBVT; Manufacturer: Texas Instruments; SymbolCreator: x0208326; CompType: IC; U/M: EA; SymbolVersion: 2013-10-23; PartNumber: UCC24650DBVR; PackageReference: DBV0005A; MountType: SMT; ComponentLink1Description: Datasheet Link; ComponentLink1URL: http://www.ti.com/lit/ds/symlink/ucc24650.pdf; RoHS: Y; Publisher: Texas Instruments; LatestRevisionDate: 2016-01-14; Alternate Manufacturer: Texas Instruments
U2 = UCC28730DR: Constant-Voltage Constant-Current Flyback Controller With PSR and Wake-Up Monitoring, D0007A; Manufacturer: Texas Instruments; SymbolCreator: x0208325; CompType: IC; U/M: EA; SymbolVersion: 2013-10-22; PartNumber: UCC28730DR; Alternate PartNumber: UCC28730D; PackageReference: D0007A; MountType: SMT; ComponentLink1Description: Datasheet Link; ComponentLink1URL: http://www.ti.com/lit/ds/symlink/ucc28730.pdf; RoHS: Y; Publisher: Texas Instruments; LatestRevisionDate: 2016-01-14; Alternate Manufacturer: Texas Instruments
U3 = TLV74333PDBVR: Low-Dropout Regulator, DBV0005A (SOT-23-5); Manufacturer: Texas Instruments; SymbolCreator: Altium; SizeArea_mm2: 8.12; SizeAreaWB_mm2: 14.82; SizeX_mm: 2.8; SizeY_mm: 2.9; SizeZ_mm: 1.45; CompType: IC; U/M: EA; SymbolVersion: 2015-02-26; PartNumber: TLV74333PDBVR; PackageReference: DBV0005A; PackageDescription: SOT-23-5; MountType: SMT; ComponentLink1Description: Datasheet Link; ComponentLink1URL: https://sps06.itg.ti.com/sites/KMS/crossdivteams/altium/docs/ComponentDatasheets/tlv733p.pdf; Publisher: Texas Instruments; LatestRevisionDate: 2017-06-23; Alternate Manufacturer: Texas Instruments